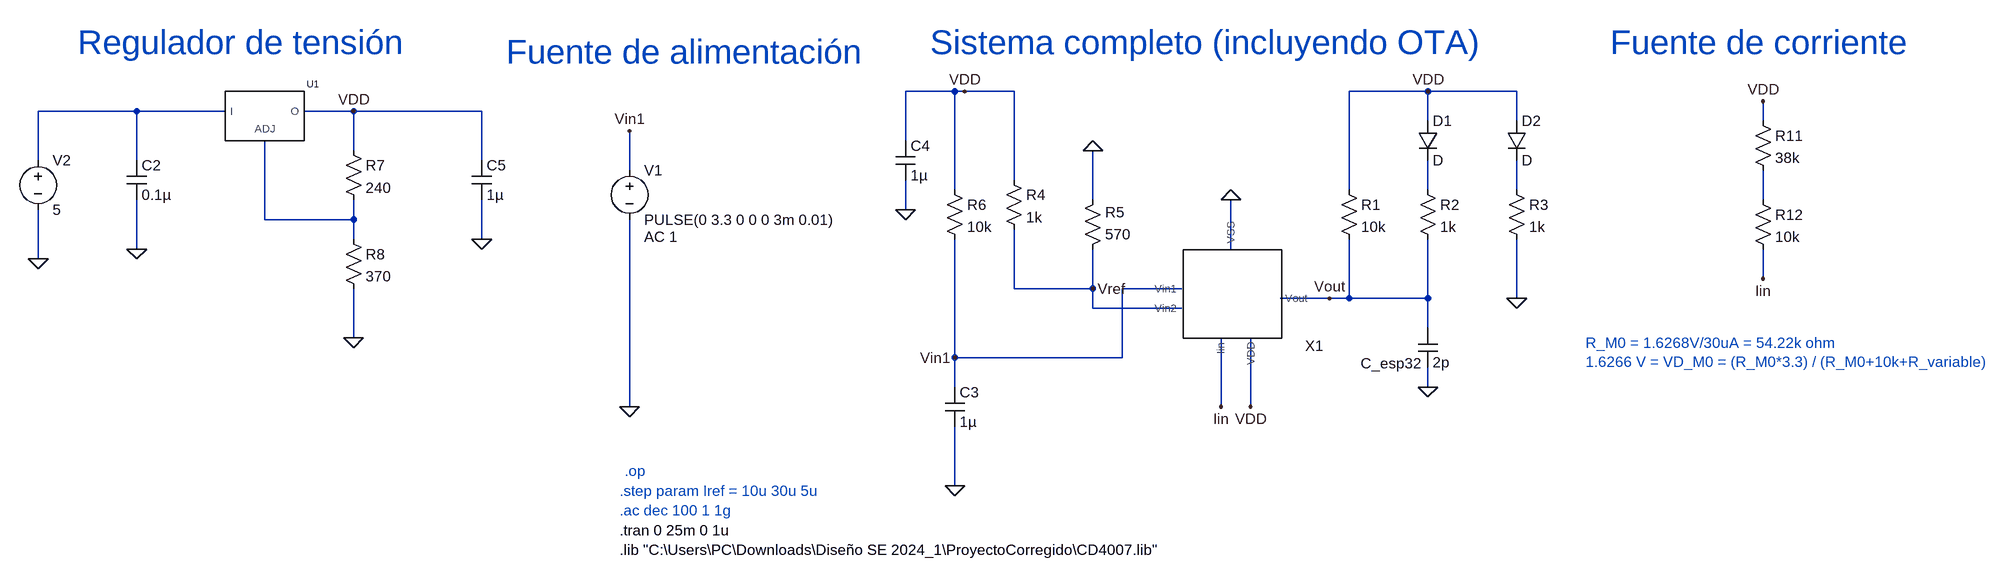
[diagram p0: schematic SistemaReal.asc]
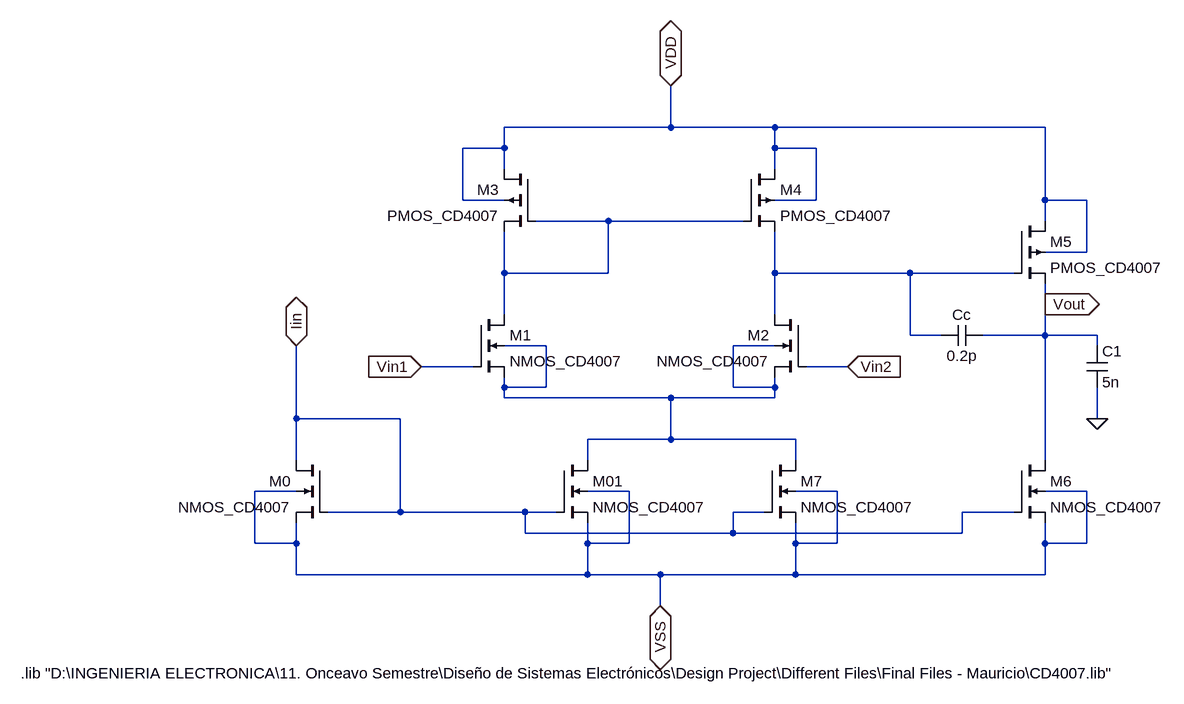
[diagram p1: sub-circuit ota_symbol.asc]
SistemaReal.asc, the LTspice schematic file:
Version 4
SHEET 1 2484 948
WIRE 752 -16 672 -16
WIRE 768 -16 752 -16
WIRE 848 -16 768 -16
WIRE 1520 -16 1392 -16
WIRE 1664 -16 1520 -16
WIRE -576 16 -736 16
WIRE -432 16 -576 16
WIRE -224 16 -304 16
WIRE -16 16 -224 16
WIRE 1520 32 1520 -16
WIRE 1664 32 1664 -16
WIRE 2064 32 2064 0
WIRE 672 64 672 -16
WIRE -224 80 -224 16
WIRE -736 96 -736 16
WIRE -576 96 -576 16
WIRE -16 96 -16 16
WIRE 224 112 224 48
WIRE 848 128 848 -16
WIRE 752 144 752 -16
WIRE 1392 144 1392 -16
WIRE 1520 144 1520 96
WIRE 1664 144 1664 96
WIRE 976 160 976 80
WIRE 2064 160 2064 112
WIRE 672 176 672 128
WIRE -368 192 -368 64
WIRE -224 192 -224 160
WIRE -224 192 -368 192
WIRE -224 224 -224 192
WIRE -16 224 -16 160
WIRE -576 240 -576 160
WIRE 1200 240 1200 160
WIRE -736 256 -736 176
WIRE 2064 288 2064 240
WIRE 848 304 848 208
WIRE 976 304 976 240
WIRE 976 304 848 304
WIRE 1120 304 1024 304
WIRE 1360 320 1280 320
WIRE 1392 320 1392 224
WIRE 1392 320 1360 320
WIRE 1520 320 1520 224
WIRE 1520 320 1392 320
WIRE 1664 320 1664 224
WIRE 976 336 976 304
WIRE 1120 336 976 336
WIRE 1520 368 1520 320
WIRE -224 384 -224 304
WIRE 752 416 752 224
WIRE 1024 416 1024 304
WIRE 1024 416 752 416
WIRE 752 464 752 416
WIRE 1520 464 1520 432
WIRE 224 496 224 192
WIRE 1184 496 1184 384
WIRE 1232 496 1232 384
WIRE 752 624 752 528
FLAG -224 16 VDD
FLAG 224 48 Vin1
FLAG 224 496 0
FLAG 976 80 0
FLAG 752 624 0
FLAG 672 176 0
FLAG 1520 464 0
FLAG 752 416 Vin1
FLAG 976 304 Vref
FLAG 1184 496 Iin
FLAG 1200 160 0
FLAG 1520 -16 VDD
FLAG 1360 320 Vout
FLAG -16 224 0
FLAG -224 384 0
FLAG -576 240 0
FLAG -736 256 0
FLAG 2064 0 VDD
FLAG 2064 288 Iin
FLAG 1232 496 VDD
FLAG 1664 320 0
FLAG 768 -16 VDD
SYMBOL voltage 224 96 R0
WINDOW 123 24 124 Left 2
WINDOW 39 0 0 Left 0
SYMATTR Value2 AC 1
SYMATTR InstName V1
SYMATTR Value PULSE(0 3.3 0 0 0 3m 0.01)
SYMBOL OTA_symbol 1216 304 M180
SYMATTR InstName X1
SYMBOL res 1376 128 R0
SYMATTR InstName R1
SYMATTR Value 10k
SYMBOL res 1504 128 R0
SYMATTR InstName R2
SYMATTR Value 1k
SYMBOL res 1648 128 R0
SYMATTR InstName R3
SYMATTR Value 1k
SYMBOL diode 1504 32 R0
SYMATTR InstName D1
SYMBOL diode 1648 32 R0
SYMATTR InstName D2
SYMBOL res 832 112 R0
SYMATTR InstName R4
SYMATTR Value 1k
SYMBOL res 960 256 M180
WINDOW 0 36 76 Left 2
WINDOW 3 36 40 Left 2
SYMATTR InstName R5
SYMATTR Value 570
SYMBOL res 736 128 R0
SYMATTR InstName R6
SYMATTR Value 10k
SYMBOL cap 736 464 R0
SYMATTR InstName C3
SYMATTR Value 1µ
SYMBOL cap 656 64 R0
SYMATTR InstName C4
SYMATTR Value 1µ
SYMBOL cap 1504 368 R0
WINDOW 0 -93 57 Left 2
SYMATTR InstName C_esp32
SYMATTR Value 2p
SYMBOL LM317 -368 16 R0
SYMATTR InstName U1
SYMBOL cap -592 96 R0
SYMATTR InstName C2
SYMATTR Value 0.1µ
SYMBOL res -240 64 R0
SYMATTR InstName R7
SYMATTR Value 240
SYMBOL res -240 208 R0
SYMATTR InstName R8
SYMATTR Value 370
SYMBOL cap -32 96 R0
SYMATTR InstName C5
SYMATTR Value 1µ
SYMBOL voltage -736 80 R0
WINDOW 123 0 0 Left 0
WINDOW 39 0 0 Left 0
SYMATTR InstName V2
SYMATTR Value 5
SYMBOL res 2048 16 R0
SYMATTR InstName R11
SYMATTR Value 38k
SYMBOL res 2048 144 R0
SYMATTR InstName R12
SYMATTR Value 10k
TEXT 208 728 Left 2 !.lib "C:\\Users\\PC\\Downloads\\Diseño SE 2024_1\\ProyectoCorregido\\CD4007.lib"
TEXT 208 696 Left 2 !.tran 0 25m 0 1u
TEXT 208 664 Left 2 ;.ac dec 100 1 1g
TEXT 208 632 Left 2 ;.step param Iref = 10u 30u 5u
TEXT 216 600 Left 2 ;.op
TEXT 1776 392 Left 2 ;R_M0 = 1.6268V/30uA = 54.22k ohm\n1.6266 V = VD_M0 = (R_M0*3.3) / (R_M0+10k+R_variable)
TEXT -672 -96 Left 5 ;Regulador de tensión
TEXT 24 -80 Left 5 ;Fuente de alimentación
TEXT 712 -96 Left 5 ;Sistema completo (incluyendo OTA)
TEXT 1816 -96 Left 5 ;Fuente de corriente

ota_symbol.asc, the sub-circuit schematic file:
Version 4
SHEET 1 2096 948
WIRE 1184 -64 1184 -128
WIRE 1184 -64 928 -64
WIRE 1344 -64 1184 -64
WIRE 1760 -64 1344 -64
WIRE 928 -32 928 -64
WIRE 928 -32 864 -32
WIRE 1344 -32 1344 -64
WIRE 1408 -32 1344 -32
WIRE 928 0 928 -32
WIRE 1344 0 1344 -32
WIRE 864 48 864 -32
WIRE 928 48 864 48
WIRE 1408 48 1408 -32
WIRE 1408 48 1344 48
WIRE 1760 48 1760 -64
WIRE 1824 48 1760 48
WIRE 1088 80 976 80
WIRE 1296 80 1088 80
WIRE 1760 80 1760 48
WIRE 1824 128 1824 48
WIRE 1824 128 1760 128
WIRE 928 160 928 96
WIRE 1088 160 1088 80
WIRE 1088 160 928 160
WIRE 1344 160 1344 96
WIRE 1552 160 1344 160
WIRE 1712 160 1552 160
WIRE 1760 208 1760 176
WIRE 928 224 928 160
WIRE 1344 224 1344 160
WIRE 1552 256 1552 160
WIRE 1600 256 1552 256
WIRE 1760 256 1760 208
WIRE 1760 256 1664 256
WIRE 1840 256 1760 256
WIRE 992 272 928 272
WIRE 1344 272 1280 272
WIRE 1840 272 1840 256
WIRE 880 304 800 304
WIRE 1456 304 1392 304
WIRE 928 336 928 320
WIRE 992 336 992 272
WIRE 992 336 928 336
WIRE 1280 336 1280 272
WIRE 1344 336 1344 320
WIRE 1344 336 1280 336
WIRE 928 352 928 336
WIRE 1184 352 928 352
WIRE 1344 352 1344 336
WIRE 1344 352 1184 352
WIRE 608 384 608 272
WIRE 768 384 608 384
WIRE 1840 384 1840 336
WIRE 1184 416 1184 352
WIRE 1184 416 1056 416
WIRE 1376 416 1184 416
WIRE 608 448 608 384
WIRE 1056 448 1056 416
WIRE 1376 448 1376 416
WIRE 1760 448 1760 256
WIRE 608 496 544 496
WIRE 1120 496 1056 496
WIRE 1440 496 1376 496
WIRE 1824 496 1760 496
WIRE 768 528 768 384
WIRE 768 528 656 528
WIRE 960 528 768 528
WIRE 1008 528 960 528
WIRE 1328 528 1280 528
WIRE 1712 528 1632 528
WIRE 960 560 960 528
WIRE 1280 560 1280 528
WIRE 1280 560 960 560
WIRE 1632 560 1632 528
WIRE 1632 560 1280 560
WIRE 544 576 544 496
WIRE 608 576 608 544
WIRE 608 576 544 576
WIRE 1056 576 1056 544
WIRE 1120 576 1120 496
WIRE 1120 576 1056 576
WIRE 1376 576 1376 544
WIRE 1440 576 1440 496
WIRE 1440 576 1376 576
WIRE 1760 576 1760 544
WIRE 1824 576 1824 496
WIRE 1824 576 1760 576
WIRE 608 624 608 576
WIRE 1056 624 1056 576
WIRE 1056 624 608 624
WIRE 1168 624 1056 624
WIRE 1376 624 1376 576
WIRE 1376 624 1168 624
WIRE 1760 624 1760 576
WIRE 1760 624 1376 624
WIRE 1168 672 1168 624
FLAG 1184 -128 VDD
IOPIN 1184 -128 BiDir
FLAG 800 304 Vin1
IOPIN 800 304 In
FLAG 1456 304 Vin2
IOPIN 1456 304 In
FLAG 1840 384 0
FLAG 608 272 Iin
IOPIN 608 272 BiDir
FLAG 1760 208 Vout
IOPIN 1760 208 Out
FLAG 1168 672 VSS
IOPIN 1168 672 BiDir
DATAFLAG 1184 352 ""
DATAFLAG 928 160 ""
DATAFLAG 1344 160 ""
DATAFLAG 1280 560 ""
DATAFLAG 1536 160 ""
DATAFLAG 848 304 ""
DATAFLAG 1424 304 ""
DATAFLAG 1760 256 ""
DATAFLAG 624 384 ""
DATAFLAG 1728 256 ""
DATAFLAG 1248 -64 ""
SYMBOL nmos4 880 224 R0
SYMATTR InstName M1
SYMATTR Value NMOS_CD4007
SYMATTR Value2 L=5u W=170u Ad=8500p As=8500p Pd=440u Ps=440u NRD=0.1 NRS=0.1
SYMBOL nmos4 1392 224 M0
SYMATTR InstName M2
SYMATTR Value NMOS_CD4007
SYMATTR Value2 L=5u W=170u Ad=8500p As=8500p Pd=440u Ps=440u NRD=0.1 NRS=0.1
SYMBOL pmos4 976 0 M0
SYMATTR InstName M3
SYMATTR Value PMOS_CD4007
SYMATTR Value2 L=5u W=360u Ad=18000p As=18000p Pd=820u Ps=820u NRS=0.54 NRD=0.54
SYMBOL pmos4 1296 0 R0
SYMATTR InstName M4
SYMATTR Value PMOS_CD4007
SYMATTR Value2 L=5u W=360u Ad=18000p As=18000p Pd=820u Ps=820u NRS=0.54 NRD=0.54
SYMBOL pmos4 1712 80 R0
SYMATTR InstName M5
SYMATTR Value PMOS_CD4007
SYMATTR Value2 L=5u W=360u Ad=18000p As=18000p Pd=820u Ps=820u NRS=0.54 NRD=0.54
SYMBOL nmos4 1712 448 R0
SYMATTR InstName M6
SYMATTR Value NMOS_CD4007
SYMATTR Value2 L=5u W=170u Ad=8500p As=8500p Pd=440u Ps=440u NRD=0.1 NRS=0.1
SYMBOL nmos4 1328 448 R0
SYMATTR InstName M7
SYMATTR Value NMOS_CD4007
SYMATTR Value2 L=5u W=170u Ad=8500p As=8500p Pd=440u Ps=440u NRD=0.1 NRS=0.1
SYMBOL nmos4 656 448 M0
SYMATTR InstName M0
SYMATTR Value NMOS_CD4007
SYMATTR Value2 L=5u W=170u Ad=8500p As=8500p Pd=440u Ps=440u NRD=0.1 NRS=0.1
SYMBOL nmos4 1008 448 R0
SYMATTR InstName M01
SYMATTR Value NMOS_CD4007
SYMATTR Value2 L=5u W=170u Ad=8500p As=8500p Pd=440u Ps=440u NRD=0.1 NRS=0.1
SYMBOL cap 1664 240 R90
WINDOW 0 0 32 VBottom 2
WINDOW 3 32 32 VTop 2
SYMATTR InstName Cc
SYMATTR Value 0.2p
SYMBOL cap 1824 272 R0
SYMATTR InstName C1
SYMATTR Value 5n
TEXT 184 776 Left 2 !.lib "D:\\INGENIERIA ELECTRONICA\\11. Onceavo Semestre\\Diseño de Sistemas Electrónicos\\Design Project\\Different Files\\Final Files - Mauricio\\CD4007.lib"

The netlist it stands for:
* SistemaReal.asc
V1 Vin1 0 PULSE(0 3.3 0 0 0 3m 0.01) AC 1
XX1 Vin1 Vref Iin VDD Vout 0 ota_symbol
R1 VDD Vout 10k
R2 N002 Vout 1k
R3 N003 0 1k
D1 VDD N002 D
D2 VDD N003 D
R4 VDD Vref 1k
R5 Vref 0 570
R6 VDD Vin1 10k
C3 Vin1 0 1µ
C4 VDD 0 1µ
C_esp32 Vout 0 2p
XU1 N001 N005 VDD LM317 LM317  ; pins I ADJ O
C2 N001 0 0.1µ
R7 VDD N005 240
R8 N005 0 370
C5 VDD 0 1µ
V2 N001 0 5
R11 VDD N004 38k
R12 N004 Iin 10k

* block symbol definitions
.subckt ota_symbol Vin1 Vin2 Iin VDD Vout VSS
M1 N001 Vin1 N003 N003 NMOS_CD4007 L=5u W=170u Ad=8500p As=8500p Pd=440u Ps=440u NRD=0.1 NRS=0.1
M2 N002 Vin2 N003 N003 NMOS_CD4007 L=5u W=170u Ad=8500p As=8500p Pd=440u Ps=440u NRD=0.1 NRS=0.1
M3 VDD N001 N001 VDD PMOS_CD4007 L=5u W=360u Ad=18000p As=18000p Pd=820u Ps=820u NRS=0.54 NRD=0.54
M4 VDD N001 N002 VDD PMOS_CD4007 L=5u W=360u Ad=18000p As=18000p Pd=820u Ps=820u NRS=0.54 NRD=0.54
M5 VDD N002 Vout VDD PMOS_CD4007 L=5u W=360u Ad=18000p As=18000p Pd=820u Ps=820u NRS=0.54 NRD=0.54
M6 Vout Iin VSS VSS NMOS_CD4007 L=5u W=170u Ad=8500p As=8500p Pd=440u Ps=440u NRD=0.1 NRS=0.1
M7 N003 Iin VSS VSS NMOS_CD4007 L=5u W=170u Ad=8500p As=8500p Pd=440u Ps=440u NRD=0.1 NRS=0.1
M0 Iin Iin VSS VSS NMOS_CD4007 L=5u W=170u Ad=8500p As=8500p Pd=440u Ps=440u NRD=0.1 NRS=0.1
M01 N003 Iin VSS VSS NMOS_CD4007 L=5u W=170u Ad=8500p As=8500p Pd=440u Ps=440u NRD=0.1 NRS=0.1
Cc Vout N002 0.2p
C1 Vout 0 5n
.lib "D:\INGENIERIA ELECTRONICA\11. Onceavo Semestre\Diseño de Sistemas Electrónicos\Design Project\Different Files\Final Files - Mauricio\CD4007.lib"
.ends ota_symbol

.model D D
.lib standard.dio
.model NMOS NMOS
.model PMOS PMOS
.lib standard.mos
.lib "C:\Users\PC\Downloads\Diseño SE 2024_1\ProyectoCorregido\CD4007.lib"
.tran 0 25m 0 1u
* .ac dec 100 1 1g
* .step param Iref = 10u 30u 5u
* .op
* R_M0 = 1.6268V/30uA = 54.22k ohm
* 1.6266 V = VD_M0 = (R_M0*3.3) / (R_M0+10k+R_variable)
* Regulador de tensión
* Fuente de alimentación
* Sistema completo (incluyendo OTA)
* Fuente de corriente
.lib LM317.sub
.backanno
.end